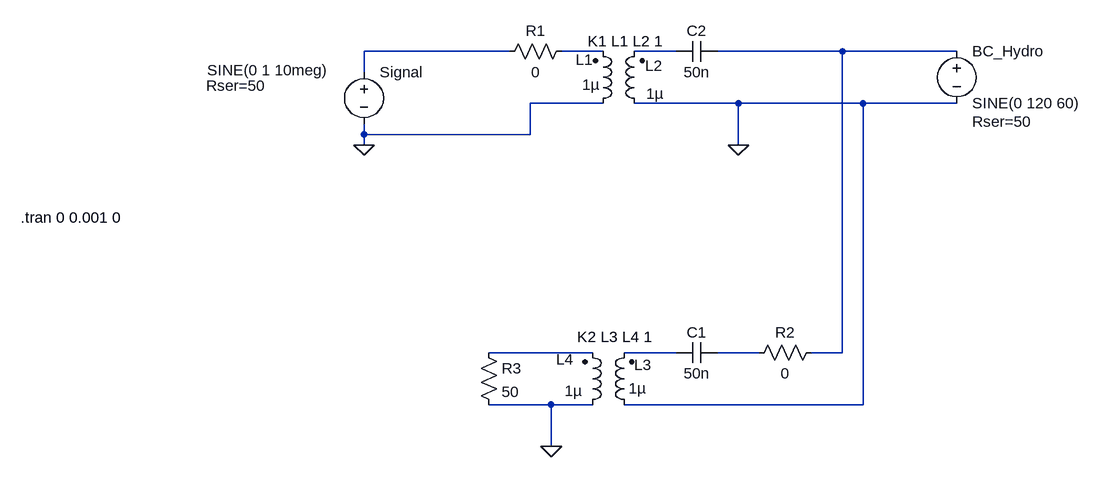
[diagram p0: schematic powerline_coupling_isolation1.asc]
powerline_coupling_isolation1.asc, the LTspice schematic file:
Version 4
SHEET 1 1236 708
WIRE 336 80 112 80
WIRE 480 80 416 80
WIRE 592 80 528 80
WIRE 848 80 656 80
WIRE 1024 80 848 80
WIRE 112 112 112 80
WIRE 480 160 368 160
WIRE 688 160 528 160
WIRE 880 160 688 160
WIRE 1024 160 880 160
WIRE 112 208 112 192
WIRE 368 208 368 160
WIRE 368 208 112 208
WIRE 112 224 112 208
WIRE 688 224 688 160
WIRE 464 544 304 544
WIRE 592 544 512 544
WIRE 720 544 656 544
WIRE 848 544 848 80
WIRE 848 544 800 544
WIRE 400 624 304 624
WIRE 464 624 400 624
WIRE 880 624 880 160
WIRE 880 624 512 624
WIRE 400 688 400 624
FLAG 112 224 0
FLAG 688 224 0
FLAG 400 688 0
SYMBOL voltage 112 96 R0
WINDOW 3 -241 13 Left 2
WINDOW 123 0 0 Left 2
WINDOW 39 -243 37 Left 2
SYMATTR Value SINE(0 1 10meg)
SYMATTR SpiceLine Rser=50
SYMATTR InstName Signal
SYMBOL res 432 64 R90
WINDOW 0 0 56 VBottom 2
WINDOW 3 32 56 VTop 2
SYMATTR InstName R1
SYMATTR Value 0
SYMBOL ind2 544 176 R180
WINDOW 0 -28 74 Left 2
WINDOW 3 -29 31 Left 2
SYMATTR InstName L2
SYMATTR Value 1µ
SYMATTR Type ind
SYMBOL ind2 464 176 M180
WINDOW 0 -26 83 Left 2
WINDOW 3 -16 45 Left 2
SYMATTR InstName L1
SYMATTR Value 1µ
SYMATTR Type ind
SYMBOL voltage 1024 64 R0
WINDOW 123 0 0 Left 2
WINDOW 39 24 124 Left 2
SYMATTR SpiceLine Rser=50
SYMATTR InstName BC_Hydro
SYMATTR Value SINE(0 120 60)
SYMBOL cap 656 64 R90
WINDOW 0 0 32 VBottom 2
WINDOW 3 32 32 VTop 2
SYMATTR InstName C2
SYMATTR Value 50n
SYMATTR SpiceLine V=250
SYMBOL ind2 528 640 R180
WINDOW 0 -27 77 Left 2
WINDOW 3 -18 41 Left 2
SYMATTR InstName L3
SYMATTR Value 1µ
SYMATTR Type ind
SYMBOL ind2 448 640 M180
WINDOW 0 -40 86 Left 2
WINDOW 3 -27 37 Left 2
SYMATTR InstName L4
SYMATTR Value 1µ
SYMATTR Type ind
SYMBOL res 816 528 R90
WINDOW 0 0 56 VBottom 2
WINDOW 3 32 56 VTop 2
SYMATTR InstName R2
SYMATTR Value 0
SYMBOL res 288 528 R0
SYMATTR InstName R3
SYMATTR Value 50
SYMBOL cap 656 528 R90
WINDOW 0 0 32 VBottom 2
WINDOW 3 32 32 VTop 2
SYMATTR InstName C1
SYMATTR Value 50n
TEXT -416 336 Left 2 !.tran 0 0.001 0
TEXT 456 64 Left 2 !K1 L1 L2 1
TEXT 440 520 Left 2 !K2 L3 L4 1

The netlist it stands for:
* powerline_coupling_isolation1.asc
V§Signal N001 0 SINE(0 1 10meg) Rser=50
R1 N002 N001 0
L2 0 N003 1µ
L1 0 N002 1µ
V§BC_Hydro N004 0 SINE(0 120 60) Rser=50
C2 N004 N003 50n V=250
L3 0 N006 1µ
L4 0 N005 1µ
R2 N004 N007 0
R3 N005 0 50
C1 N007 N006 50n
.tran 0 0.001 0
K1 L1 L2 1
K2 L3 L4 1
.backanno
.end